# Altium schematic sheet bat_charging.SchDoc
size Letter; Author: Ye-Sheng Kuo; Organization: Altium Limited; Address1: L3, 12a Rodborough Rd; Address2: Frenchs Forest; Address3: NSW; Address4: Australia 2086; Revision: 1
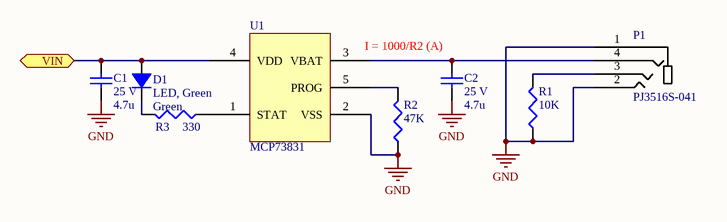
[diagram p0: bat_charging.SchDoc]

## Parts
C1  value 4.7u  voltage rated: 25 V  [0805]  (hidden comment: Ceramic capacitor)
C2  value 4.7u  voltage rated: 25 V  [0805]  (hidden comment: Ceramic capacitor)
D1  LED, Green  Color: Green  [0603 - LED]
P1  PJ3516S-041  [PJ3516S-041]
R1  value 10K  [0603]  (hidden comment: Chip resistor)
R2  value 47K  [0603]  (hidden comment: Chip resistor)
R3  value 330  [0603]  (hidden comment: Chip resistor)
U1  MCP73831  [TSOT23-5]

## Ports
VIN

## Nets
GND: C1.2 C2.2 P1.1 P1.2 R1.2 R2.2 U1.2(VSS)
VIN: C1.1 D1.1 U1.4(VDD) ; port VIN
NetC2_1: C2.1 P1.4 U1.3(VBAT)
NetD1_2: D1.2 R3.1
NetP1_3: P1.3 R1.1
NetR2_1: R2.1 U1.5(PROG)
NetR3_2: R3.2 U1.1(STAT)

## Notes on the sheet
- I = 1000/R2 (A)
- Title
- Date:
- Author:
- Revision:
- Sheet
- of
- University of Michigan
- File:

## Library data of the parts
C1 C2 = C_4.7u_25V_0805_ceramic: Ceramic capacitor, 4.7 uF, 25 V, 0805 package; Manufacture: Murata; tolerance: 10%; Temperature Coefficient: X5R; package: 0805; Supplier 1: Digi-Key; Supplier Part Number 1: 490-3335-1-ND
D1 = D_LED_GREEN_0603: LED, Green,  0603; package: 0603; Supplier 1: Digi-Key; Supplier Part Number 1: 160-1446-1-ND
P1 = PJ3516S-041: 3.5 mm phone jack, 4 terminals
R1 = R_10K_0603: Chip resistor, 10K, 0603 package; tolerance: 1%; power: 1/10 W; package: 0603; Supplier 1: Digi-Key; Supplier Part Number 1: 541-10.0KHCT-ND
R2 = R_47K_0603: Chip resistor, 47K, 0603 package; tolerance: 1%; power: 1/10 W; package: 0603; Supplier 1: Digi-Key; Supplier Part Number 1: 541-47.0KHCT-ND
R3 = R_330_0603: Chip resistor, 330, 0603 package; tolerance: 1%; power: 1/10 W; package: 0603; Supplier 1: Digi-Key; Supplier Part Number 1: 541-330HCT-ND
U1 = MCP73831: Miniature Single-Cell, Fully Integrated Li-Ion,  Li-Polymer Charge Management Controllers; Supplier 1: Digi-Key; Supplier Part Number 1: MCP73831T-2ATI/OTCT-ND